# Altium schematic sheet POWER.SchDoc
size A4
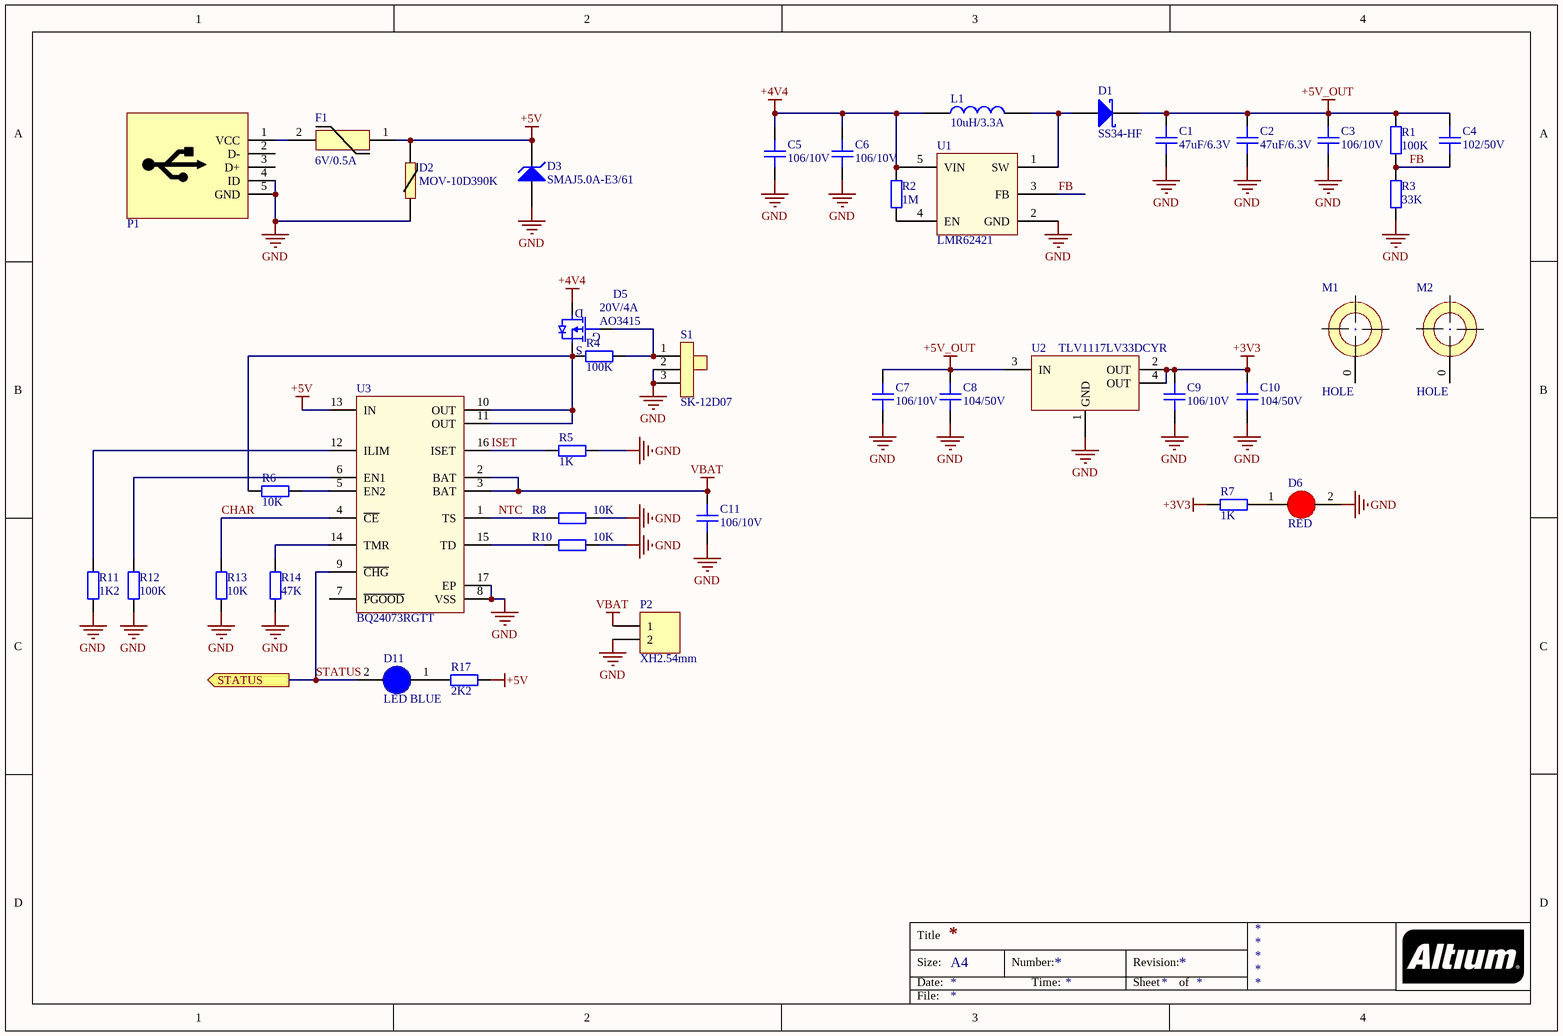
[diagram p0: POWER.SchDoc]

## Parts
C1  47uF/6.3V  [CAPC-0603 (1608) - HD]
C2  47uF/6.3V  [CAPC-0603 (1608) - HD]
C3  106/10V  [CAPC-0603 (1608) - HD]
C4  102/50V  [CAPC-0603 (1608) - HD]
C5  106/10V  [CAPC-0603 (1608) - HD]
C6  106/10V  [CAPC-0603 (1608) - HD]
C7  106/10V  [CAPC-0603 (1608) - HD]
C8  104/50V  [CAPC-0603 (1608) - HD]
C9  106/10V  [CAPC-0603 (1608) - HD]
C10  104/50V  [CAPC-0603 (1608) - HD]
C11  106/10V  [CAPC-0603 (1608) - HD]
D1  SS34-HF  [DIODE_DO214AC_SMA]
D2  MOV-10D390K  [MOV-07D101KTR]
D3  SMAJ5.0A-E3/61  [DIODE_DO214AC_SMA]
D5  20V/4A  [SOT23_3]
D6  RED  [LED 0603]
D11  LED BLUE  [LED_3MM-RED - duplicate]
F1  6V/0.5A  [FUSE 0ZCK_BEL]
L1  10uH/3.3A  [IND-74404084150]
M1  HOLE  [HOLE_3MM_6MM]  (no BOM)
M2  HOLE  [HOLE_3MM_6MM]  (no BOM)
P1  Micro USB  [MK5P MICROUSB]  (value not drawn)
P2  XH2.54mm  [XH2.54-2P]
R1  100K  [RESC-0603 (1608) - HD]
R2  1M  [RESC-0603 (1608) - HD]
R3  33K  [RESC-0603 (1608) - HD]
R4  100K  [RESC-0603 (1608) - HD]
R5  1K  [RESC-0603 (1608) - HD]
R6  10K  [RESC-0603 (1608) - HD]
R7  1K  [RESC-0603 (1608) - HD]
R8  10K  [RESC-0603 (1608) - HD]
R10  10K  [RESC-0603 (1608) - HD]
R11  1K2  [RESC-0603 (1608) - HD]
R12  100K  [RESC-0603 (1608) - HD]
R13  10K  [RESC-0603 (1608) - HD]
R14  47K  [RESC-0603 (1608) - HD]
R17  2K2  [RESC-0603 (1608) - HD]
S1  SK-12D07  [SK-12D07]
U1  LMR62421  [SC-74A]
U2  TLV1117LV33DCYR  [SOT-223-4]
U3  BQ24073RGTT  [RGT16-1700X1700TP]

## Ports
STATUS (out)

## Nets
+3V3: C9.2 C10.2 R7.1 U2.2(OUT) U2.4(OUT)
+4V4: C5.2 C6.2 D5.3(D) L1.1 R2.2 U1.5(VIN)
+5V: D2.2(K) D3.2(K) F1.1 R17.2 U3.13(IN)
+5V_OUT: C1.2 C2.2 C3.2 C4.2 C7.2 C8.2 D1.2(K) R1.2 U2.3(IN)
GND: C1.1 C2.1 C3.1 C5.1 C6.1 C7.1 C8.1 C9.1 C10.1 C11.1 D2.1(A) D3.1(A) D6.2(K) P1.4(ID) P1.5(GND) P2.2 R3.1 R5.2 R8.2 R10.2 R11.1 R12.1 R13.1 R14.1 S1.2(+) S1.3(+) U1.2(GND) U2.1(GND) U3.8(VSS) U3.17(EP)
VBAT: C11.2 P2.1 U3.2(BAT) U3.3(BAT)
CHAR: R13.2 U3.4(~{CE})
FB: C4.1 R1.1 R3.2 U1.3(FB)
ISET: R5.1 U3.16(ISET)
NTC: R8.1 U3.1(TS)
STATUS: D11.2(K) U3.9(~{CHG}) ; port STATUS
NetD1_1: D1.1(A) L1.2 U1.1(SW)
NetD5_1: D5.1(G) R4.1 S1.1(+)
NetD5_2: D5.2(S) R4.2 R6.1 U3.10(OUT) U3.11(OUT)
NetD6_1: D6.1(A) R7.2
NetD11_1: D11.1(A) R17.1
NetF1_2: F1.2 P1.1(VCC)
NetR2_1: R2.1 U1.4(EN)
NetR6_2: R6.2 U3.5(EN2)
NetR10_1: R10.1 U3.15(TD)
NetR11_2: R11.2 U3.12(ILIM)
NetR12_2: R12.2 U3.6(EN1)
NetR14_2: R14.2 U3.14(TMR)

Not connected (* = marked no-connect by the designer): M1 0; M2 0; P1 2(D-) 3(D+); U3 7(~{PGOOD})

## Notes on the sheet
- Title
- Size:
- Date:
- A4
- Number:
- Time:
- Revision:
- Sheet
- of
- File:

## Library data of the parts
C1 C2 = GRM188R60J476ME15D: CAP CER 47UF 6.3V X5R 0603; MFR: Murata Electronics; MPN: GRM188R60J476ME15D; Value: 47uF/6.3V; Category: CAPACITOR; SOLDER: CAP-0603
C3 C5 C6 C11 = CL10A106KP8NNNC: CAP CER 10uF 10% 10V X5R 0603; MFR: Samsung Electro-Mechanics; Solder: SMT; Conpany ID: VT00807; MPN: CL10A106KP8NNNC; Value: 106/10V; Category: Capacitor
C4 = CL10B102KB8NNNC: CAP CER 1000pF 10% 50V X7R 0603; Solder: SMT; Company ID: VT00062; Value: 102/50V; MPN: CL10B102KB8NNNC
C7 C9 = CL10A106KP8NNNC: CAP CER 10uF 10% 10V X5R 0603; CompanyID: VT-00984; Solder: SMT; MPN: CL10A106KP8NNNC; Value: 106/10V; Category: CAPACITOR
C8 C10 = C0603C104K5RACTU: CAP CER 0.1uF 50V 10% X7R 0603; Solder: SMT; Company ID: VT00574; MPN: C0603C104K5RACTU; Value: 104/50V
D1 = SS34-HF: DIODE SCHOTTKY 40V 3A SMA; MFR: onsemi; Solder: DO214AC; Company ID: VT00542; MPN: SS34-HF; Value: SS34-HF
D2 = MOV-10D390K: VARISTOR 39V 500A DISC 10MM; MFR: Bourns Inc.; Solder: WAVE; Value: MOV-10D390K; Category: VARISTOR; MPN: MOV-10D390K
D3 = SMAJ5.0A-E3/61: DIODE TVS 5VWM 9.2VC SMA; Solder: SMT; Company ID: VT00183; Value: SMAJ5.0A-E3/61; MPN: SMAJ5.0A-E3/61
D5 = AO3415: MOSFET P-CH 20V 4A SOT23; MFR: Alpha & Omega Semiconductor Inc.; Company ID: VT00490; CATEGORY: DIODE; SOLDER: SOT23; VALUE: 20V/4A; MPN: AO3415
D6 = LED 0603 RED: Solder: 0603; Company ID: VT00361; MPN: LED 0603 RED; Category: LED Diode; Value: RED
D11 = LED BLUE 3MM: LED BLUE 3MM ROUND T/H; MFR: China; Solder: WAVE; MPN: LED BLUE 3MM; Value: LED BLUE
F1 = 0ZCK0050FF2E: PTC RESET FUSE 6V 500MA 0805; Manufacturer: Bel Fuse Inc.; Solder: SMT; Company ID: VT00196; MPN: 0ZCK0050FF2E; Category: Fuse; Value: 6V/0.5A
L1 = SWPA8040S100MT: FIXED IND 10UH 3.3A 38 MOHM SMD; MFR: Shenzhen Sunlord Electronics Co., Ltd.; DCR: 38mOhm; MPN: SWPA8040S100MT; VALUE: 10uH/3.3A; CATEGORY: INDUCTOR
M1 M2 = HOLE_2_4/2_5/3_5/3_6: HOLE 2_4/2_5/3_5/3_6; MPN: None; Solder: Not Fill; CompanyID: VT-; ClassName: MECH_HOLE; Value: HOLE
P1 = MK5P_DIP: Micro USB Right Angle MK5P DIP; MFR: China; Solder: WAVE; LKCL: CL08132; MPN: MK5P_DIP; Category: CONNECTOR; Company ID: *; Value: Micro USB
P2 = XH2.54-2P: XH2.54mmm - 2P 180 degree; MFR: China; Company ID: VT01144; MPN: XH2.54-2P; Value: XH2.54mm
R1 R4 = RC0603FR-07100KL: RES SMD 100K OHM 1% 1/10W 0603; MFR: Yageo; Solder: SMT; Company ID: VT00424; MPN: RC0603FR-07100KL; Value: 100K; Category: Resistor
R2 = CRCW06031M00FKEA: RES SMD 1M OHM 1% 1/10W 0603; MFR: Vishay Dale; Solder: SMT; Company ID: VT00405; MPN: CRCW06031M00FKEA; Value: 1M; Category: Resistor
R3 = RC0603FR-0733KL: RES SMD 33K OHM 1% 1/10W 0603; Solder: SMT; MPN: RC0603FR-0733KL; Value: 33K
R5 R7 = RC0603FR-071KL: RES SMD 1 KOHM 1% 1/10W 0603; Solder: SMT; Company ID: VT00433; MPN: RC0603FR-071KL; Value: 1K
R6 R8 R10 R13 = RC0603FR-0710KL: RES SMD 10K OHM 1% 1/10W 0603; CompanyID: VT-00328; Solder: SMT; MPN: RC0603FR-0710KL; Value: 10K
R11 = RC0603FR-071K2L: RES SMD 1.2K OHM 1% 1/10W 0603; CompanyID: VT-01075; Solder: SMT; Value: 1K2; MPN: RC0603FR-071K2L
R12 = RC0603FR-07100KL: RES SMD 100K OHM 1% 1/10W 0603; Solder: SMT; CompanyID: VT-00332; MPN: RC0603FR-07100KL; Value: 100K
R14 = RC0603FR0747KL: RES SMD 47K OHM 1% 1/10W 0603; CompanyID: VT-00322; Solder: SMT; Value: 47K; MPN: RC0603FR0747KL
R17 = CRCW06032K20FKEA: RES SMD 2.2K OHM 1% 1/10W 0603; Solder: SMT; Company ID: VT00406; MPN: CRCW06032K20FKEA; Value: 2K2
S1 = SK-12D07: SK-12D07 Switch 5P; MFR: ChinaDaier; MPN: SK-12D07; Value: SK-12D07; Company ID: *
U1 = LMR62421XMFX/NOPB: IC REG BST SEPIC ADJ 2.1A SOT23; MFR: TI; Solder: SOT-753; MPN: LMR62421XMFX/NOPB; Category: IC; Company ID: *; Value: LMR62421
U2 = TLV1117LV33DCYR: IC REG LINEAR 3.3V 1A SOT223-4; Solder: SMT; Company ID: VT00286; Value: TLV1117LV33DCYR; MPN: TLV1117LV33DCYR; Category: IC
U3 = BQ24073RGTT: IC LI-ION CHARGE/PWR MGMT 16-QFN; MFR: Texas Instruments; Solder: 16-QFN (3x3); Company ID: VT00206; MPN: BQ24073RGTT; Category: IC; Value: BQ24073RGTT